# Altium schematic sheet Main.SchDoc
size A3; DocumentNumber: 1; SheetNumber: 1; SheetTotal: 10
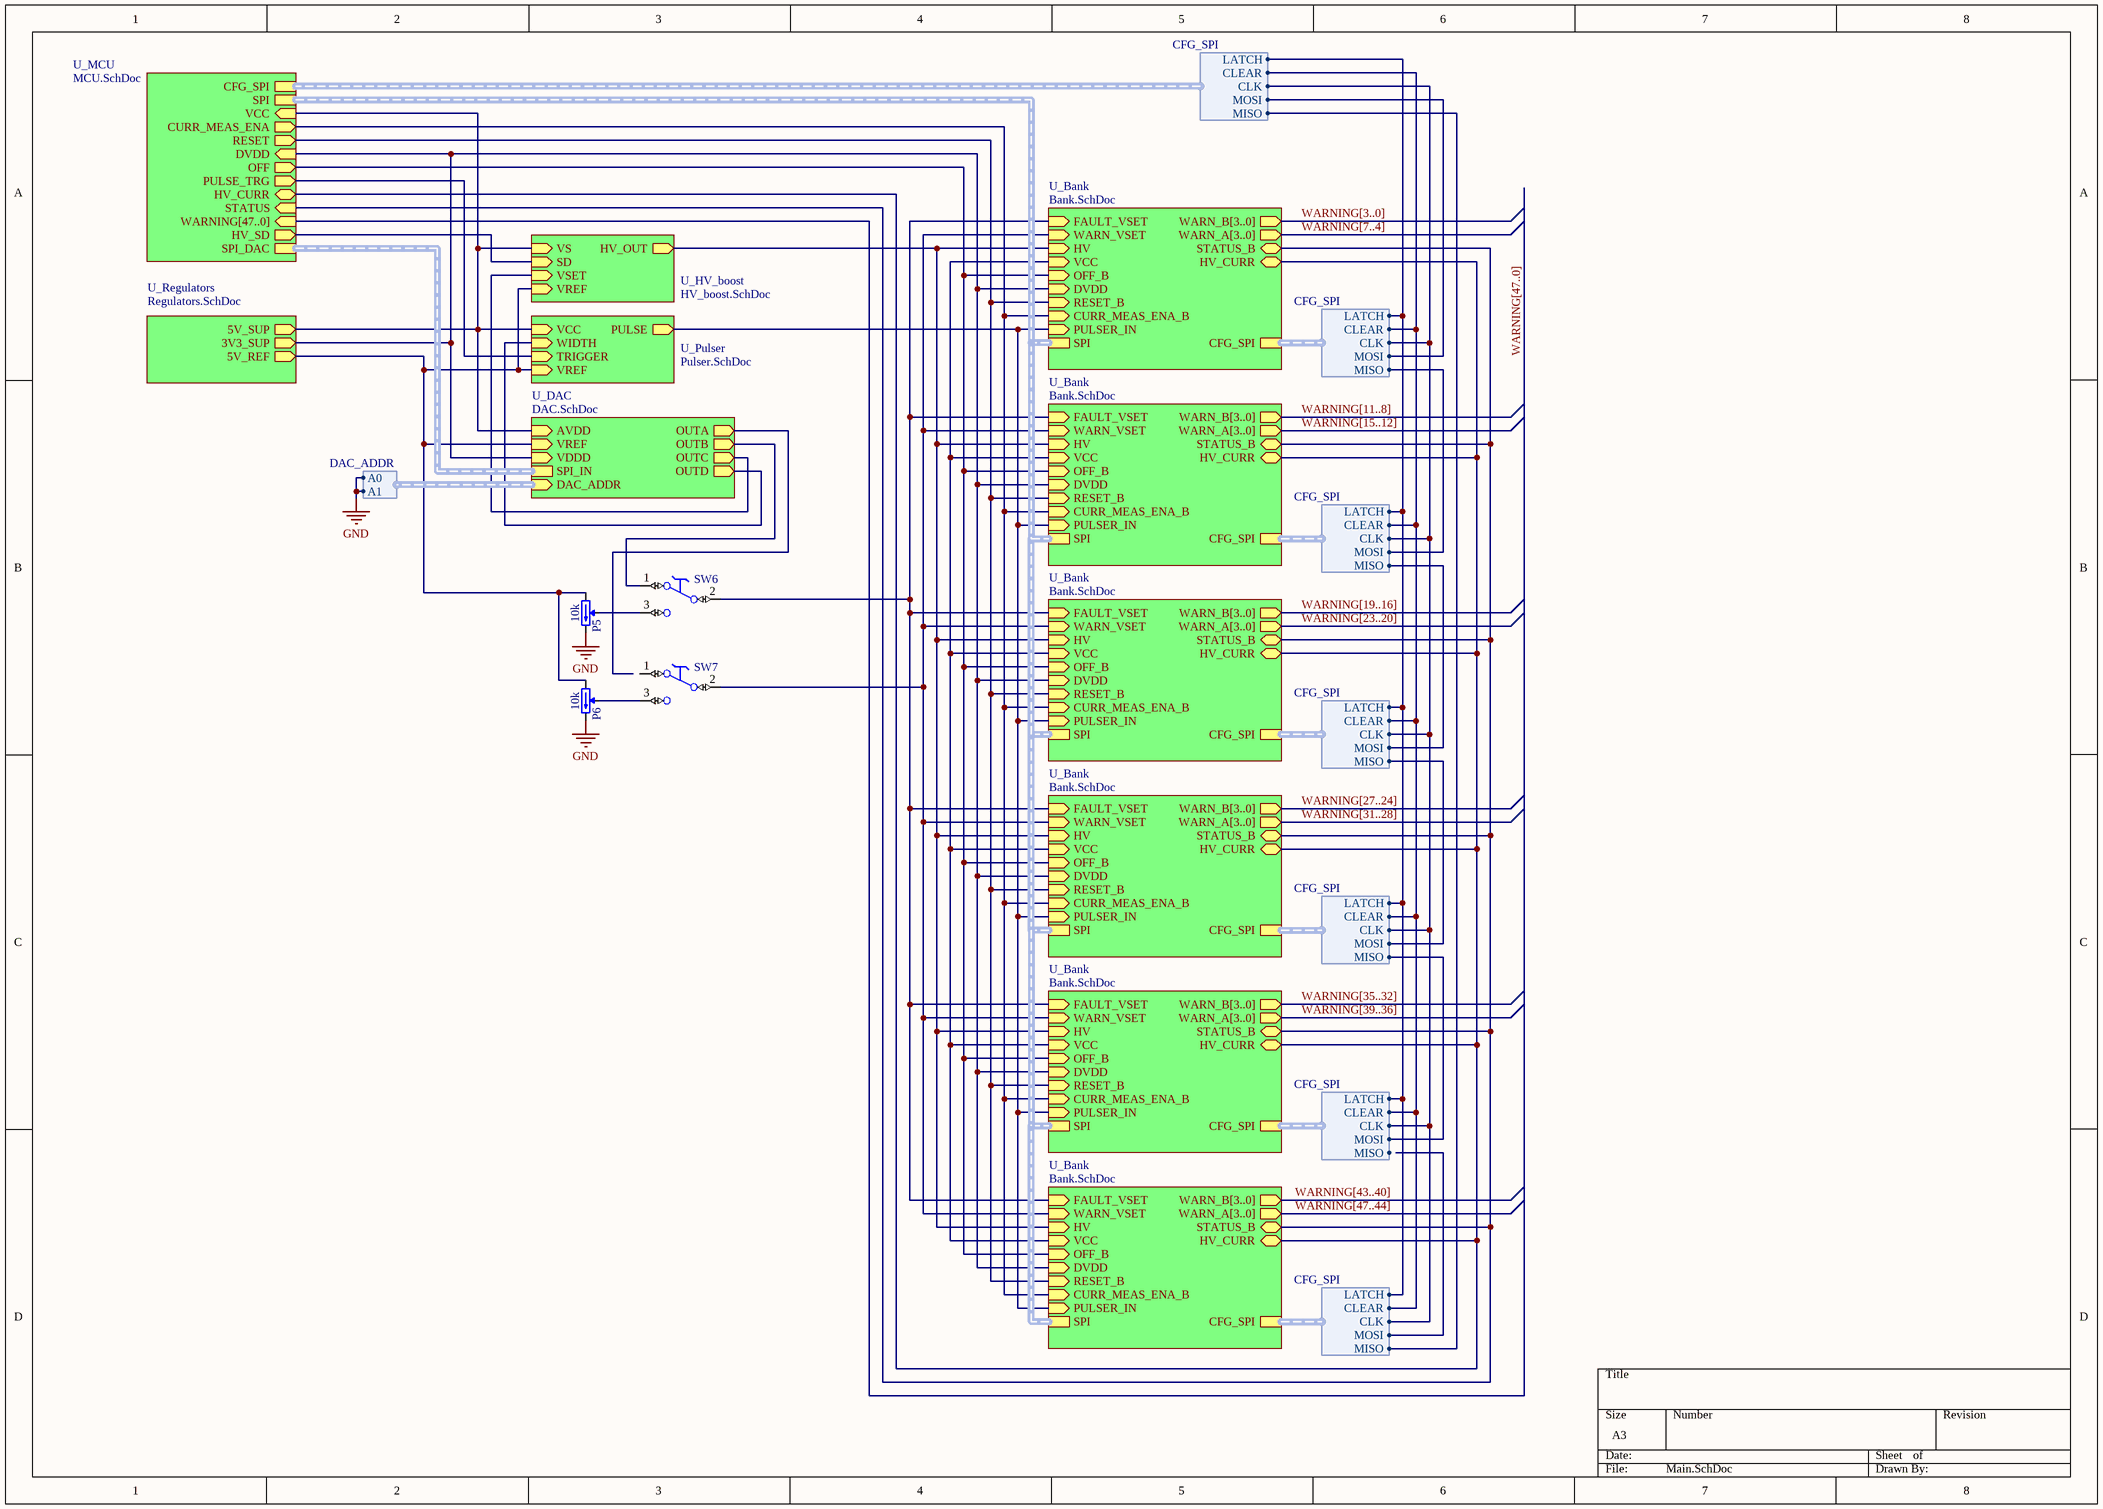
[diagram p0: Main.SchDoc]

## Parts
P5  10k  [TRIM_BOURNS_3266W]
P6  10k  [TRIM_BOURNS_3266W]
SW6  Switch  [SW_TYCO_1-1437575-4]  (value not drawn)
SW7  Switch  [SW_TYCO_1-1437575-4]  (value not drawn)

## Sub-sheets
U_Bank = Bank.SchDoc: FAULT_VSET (in), WARN_VSET (in), HV (in), VCC (in), OFF_B (in), DVDD (in), RESET_B (in), CURR_MEAS_ENA_B (in), PULSER_IN (in), SPI (harness SPI), CFG_SPI (harness CFG_SPI), WARN_B[3..0] (out), WARN_A[3..0] (out), STATUS_B (bidir), HV_CURR (bidir)
U_Bank = Bank.SchDoc: FAULT_VSET (in), WARN_VSET (in), HV (in), VCC (in), OFF_B (in), DVDD (in), RESET_B (in), CURR_MEAS_ENA_B (in), PULSER_IN (in), SPI (harness SPI), CFG_SPI (harness CFG_SPI), WARN_B[3..0] (out), WARN_A[3..0] (out), STATUS_B (bidir), HV_CURR (bidir)
U_Bank = Bank.SchDoc: FAULT_VSET (in), WARN_VSET (in), HV (in), VCC (in), OFF_B (in), DVDD (in), RESET_B (in), CURR_MEAS_ENA_B (in), PULSER_IN (in), SPI (harness SPI), CFG_SPI (harness CFG_SPI), WARN_B[3..0] (out), WARN_A[3..0] (out), STATUS_B (bidir), HV_CURR (bidir)
U_Bank = Bank.SchDoc: FAULT_VSET (in), WARN_VSET (in), HV (in), VCC (in), OFF_B (in), DVDD (in), RESET_B (in), CURR_MEAS_ENA_B (in), PULSER_IN (in), SPI (harness SPI), CFG_SPI (harness CFG_SPI), WARN_B[3..0] (out), WARN_A[3..0] (out), STATUS_B (bidir), HV_CURR (bidir)
U_Bank = Bank.SchDoc: FAULT_VSET (in), WARN_VSET (in), HV (in), VCC (in), OFF_B (in), DVDD (in), RESET_B (in), CURR_MEAS_ENA_B (in), PULSER_IN (in), SPI (harness SPI), CFG_SPI (harness CFG_SPI), WARN_B[3..0] (out), WARN_A[3..0] (out), STATUS_B (bidir), HV_CURR (bidir)
U_Bank = Bank.SchDoc: FAULT_VSET (in), WARN_VSET (in), HV (in), VCC (in), OFF_B (in), DVDD (in), RESET_B (in), CURR_MEAS_ENA_B (in), PULSER_IN (in), SPI (harness SPI), CFG_SPI (harness CFG_SPI), WARN_B[3..0] (out), WARN_A[3..0] (out), STATUS_B (bidir), HV_CURR (bidir)
U_DAC = DAC.SchDoc: AVDD (in), VREF (in), VDDD (in), SPI_IN (harness SPI_DAC), DAC_ADDR (in, harness DAC_ADDR), OUTA (out), OUTB (out), OUTC (out), OUTD (out)
U_HV_boost = HV_boost.SchDoc: VS (in), HV_OUT (out), SD (in), VSET (in), VREF (in)
U_MCU = MCU.SchDoc: STATUS (in), OFF (out), RESET (out), CURR_MEAS_ENA (out), SPI (harness SPI), CFG_SPI (harness CFG_SPI), WARNING[47..0] (in), DVDD (in), VCC (in), HV_CURR (bidir), PULSE_TRG (out), HV_SD (out), SPI_DAC (harness SPI_DAC)
U_Pulser = Pulser.SchDoc: VCC (in), WIDTH (in), TRIGGER (in), PULSE (out), VREF (in)
U_Regulators = Regulators.SchDoc: 5V_SUP (out), 3V3_SUP (out), 5V_REF (out)

## Harnesses
DAC_ADDR: A0, A1
CFG_SPI: LATCH, CLEAR, CLK, MOSI, MISO

## Nets
GND: P5.3(CW) P6.3(CW) ; sheet U_DAC/DAC_ADDR.A0, sheet U_DAC/DAC_ADDR.A1
NetP5_1: P5.1(CCW) P6.1(CCW) ; sheet U_Pulser/VREF, sheet U_HV_boost/VREF, sheet U_DAC/VREF, sheet U_Regulators/5V_REF
NetP5_2: P5.2(W) SW6.3(NO)
NetP6_2: P6.2(W) SW7.3(NO)
NetSW6_1: SW6.1(NC) ; sheet U_DAC/OUTB
NetSW6_2: SW6.2(C) ; sheet U_Bank/FAULT_VSET, sheet U_Bank/FAULT_VSET, sheet U_Bank/FAULT_VSET, sheet U_Bank/FAULT_VSET, sheet U_Bank/FAULT_VSET, sheet U_Bank/FAULT_VSET
NetSW7_2: SW7.2(C) ; sheet U_Bank/WARN_VSET, sheet U_Bank/WARN_VSET, sheet U_Bank/WARN_VSET, sheet U_Bank/WARN_VSET, sheet U_Bank/WARN_VSET, sheet U_Bank/WARN_VSET
(unnamed): sheet U_Pulser/VCC, sheet U_HV_boost/VS, sheet U_MCU/VCC, sheet U_DAC/AVDD, sheet U_Regulators/5V_SUP
(unnamed): sheet U_Pulser/WIDTH, sheet U_DAC/OUTD
(unnamed): sheet U_Pulser/TRIGGER, sheet U_MCU/PULSE_TRG
(unnamed): sheet U_Pulser/PULSE, sheet U_Bank/PULSER_IN, sheet U_Bank/PULSER_IN, sheet U_Bank/PULSER_IN, sheet U_Bank/PULSER_IN, sheet U_Bank/PULSER_IN, sheet U_Bank/PULSER_IN
(unnamed): sheet U_HV_boost/HV_OUT, sheet U_Bank/HV, sheet U_Bank/HV, sheet U_Bank/HV, sheet U_Bank/HV, sheet U_Bank/HV, sheet U_Bank/HV
(unnamed): sheet U_HV_boost/SD, sheet U_MCU/HV_SD
(unnamed): sheet U_HV_boost/VSET, sheet U_DAC/OUTC
(unnamed): sheet U_MCU/STATUS, sheet U_Bank/STATUS_B, sheet U_Bank/STATUS_B, sheet U_Bank/STATUS_B, sheet U_Bank/STATUS_B, sheet U_Bank/STATUS_B, sheet U_Bank/STATUS_B
(unnamed): sheet U_MCU/OFF, sheet U_Bank/OFF_B, sheet U_Bank/OFF_B, sheet U_Bank/OFF_B, sheet U_Bank/OFF_B, sheet U_Bank/OFF_B, sheet U_Bank/OFF_B
(unnamed): sheet U_MCU/RESET, sheet U_Bank/RESET_B, sheet U_Bank/RESET_B, sheet U_Bank/RESET_B, sheet U_Bank/RESET_B, sheet U_Bank/RESET_B, sheet U_Bank/RESET_B
(unnamed): sheet U_MCU/CURR_MEAS_ENA, sheet U_Bank/CURR_MEAS_ENA_B, sheet U_Bank/CURR_MEAS_ENA_B, sheet U_Bank/CURR_MEAS_ENA_B, sheet U_Bank/CURR_MEAS_ENA_B, sheet U_Bank/CURR_MEAS_ENA_B, sheet U_Bank/CURR_MEAS_ENA_B
(unnamed): sheet U_MCU/DVDD, sheet U_Bank/DVDD, sheet U_DAC/VDDD, sheet U_Regulators/3V3_SUP, sheet U_Bank/DVDD, sheet U_Bank/DVDD, sheet U_Bank/DVDD, sheet U_Bank/DVDD, sheet U_Bank/DVDD
(unnamed): sheet U_MCU/HV_CURR, sheet U_Bank/HV_CURR, sheet U_Bank/HV_CURR, sheet U_Bank/HV_CURR, sheet U_Bank/HV_CURR, sheet U_Bank/HV_CURR, sheet U_Bank/HV_CURR
(unnamed): sheet U_Bank/VCC, sheet U_Bank/VCC, sheet U_Bank/VCC, sheet U_Bank/VCC, sheet U_Bank/VCC, sheet U_Bank/VCC
(unnamed): sheet U_Bank/CFG_SPI.LATCH, sheet U_MCU/CFG_SPI.LATCH
(unnamed): sheet U_Bank/CFG_SPI.CLEAR, sheet U_MCU/CFG_SPI.CLEAR
(unnamed): sheet U_Bank/CFG_SPI.CLK, sheet U_MCU/CFG_SPI.CLK
(unnamed): sheet U_Bank/CFG_SPI.MOSI, sheet U_MCU/CFG_SPI.MOSI
(unnamed): sheet U_Bank/CFG_SPI.MISO, sheet U_Bank/CFG_SPI.MOSI
(unnamed): sheet U_Bank/CFG_SPI.MISO, sheet U_Bank/CFG_SPI.MOSI
(unnamed): sheet U_Bank/CFG_SPI.MISO, sheet U_Bank/CFG_SPI.MOSI
(unnamed): sheet U_Bank/CFG_SPI.MISO, sheet U_Bank/CFG_SPI.MOSI
(unnamed): sheet U_Bank/CFG_SPI.MISO, sheet U_MCU/CFG_SPI.MISO

Not connected (* = marked no-connect by the designer): SW7 1(NC)

## Buses and harness runs
bus WARNING[3..0] = sheet U_Bank/WARN_B[3..0]
bus WARNING[7..4] = sheet U_Bank/WARN_A[3..0]
bus WARNING[11..8] = sheet U_Bank/WARN_B[3..0]
bus WARNING[15..12] = sheet U_Bank/WARN_A[3..0]
bus WARNING[19..16] = sheet U_Bank/WARN_B[3..0]
bus WARNING[23..20] = sheet U_Bank/WARN_A[3..0]
bus WARNING[27..24] = sheet U_Bank/WARN_B[3..0]
bus WARNING[31..28] = sheet U_Bank/WARN_A[3..0]
bus WARNING[35..32] = sheet U_Bank/WARN_B[3..0]
bus WARNING[39..36] = sheet U_Bank/WARN_A[3..0]
bus WARNING[43..40] = sheet U_Bank/WARN_B[3..0]
bus WARNING[47..0] = sheet U_MCU/WARNING[47..0]
bus WARNING[47..44] = sheet U_Bank/WARN_A[3..0]
harness sheet U_Bank/SPI = sheet U_MCU/SPI
harness sheet U_DAC/SPI_IN = sheet U_MCU/SPI_DAC

## Library data of the parts
P5 P6 = TRIM_12T_10K_BOURNS_3266W-1-103LF: Trimming Potentiometer; Part Description: 12 Turn Trimming Potentiometer (Top Adjustement); Manufacturer: BOURNS; Power: 0.25W; TC: ±100ppm/°C; Tolerance: ±10%; PressFit: No; Part Number: TRIM_12T_10K_BOURNS_3266W-1-103LF; Component Kind: Standard; Component Type: Standard; Pin Count: 3; Value: 10k; Manufacturer Part Number: 3266W-1-103LF; Case: 3266W; Mounted: Yes; Socket: No; SMD: No; Sense: No; ComponentHeight: 7.75mm; HelpURL: \\cern.ch\dfs\Applications\Altium\Datasheets\TRIM_BOURNS_3266W.pdf; Author: CERN DEM JLC; CreateDate: 10.06.2008; LatestRevisionDate: 28.11.2012
SW6 SW7 = SW_TYCO_1-1437575-4: SPDT Switch; Part Description: 30VDC, 100mA, Slide Low Profile SPDT Switch, SSA Series; Manufacturer: TYCO; Manufacturer Part Number: 1-1437575-4 or SSA-12; PressFit: No; Part Number: SW_TYCO_1-1437575-4; Component Kind: Standard; Component Type: Standard; Pin Count: 3; PackageDescription: Body 8.79 x 3.4mm, Slide Low Profile SPDT Switch, SSA Series; Family: Switch; Mounted: Yes; Socket: No; SMD: No; Sense: No; Status: None; ComponentHeight: 5.4mm; HelpURL: \\cern.ch\dfs\Applications\Altium\Datasheets\SW_TYCO_1-1437575-4.pdf; Author: CERN DEM JLC; CreateDate: 11.11.2013; LatestRevisionDate: 11.11.2013